# Altium schematic sheet Protection_Circuit.SchDoc
size A2; SheetNumber: 1; SheetTotal: 3
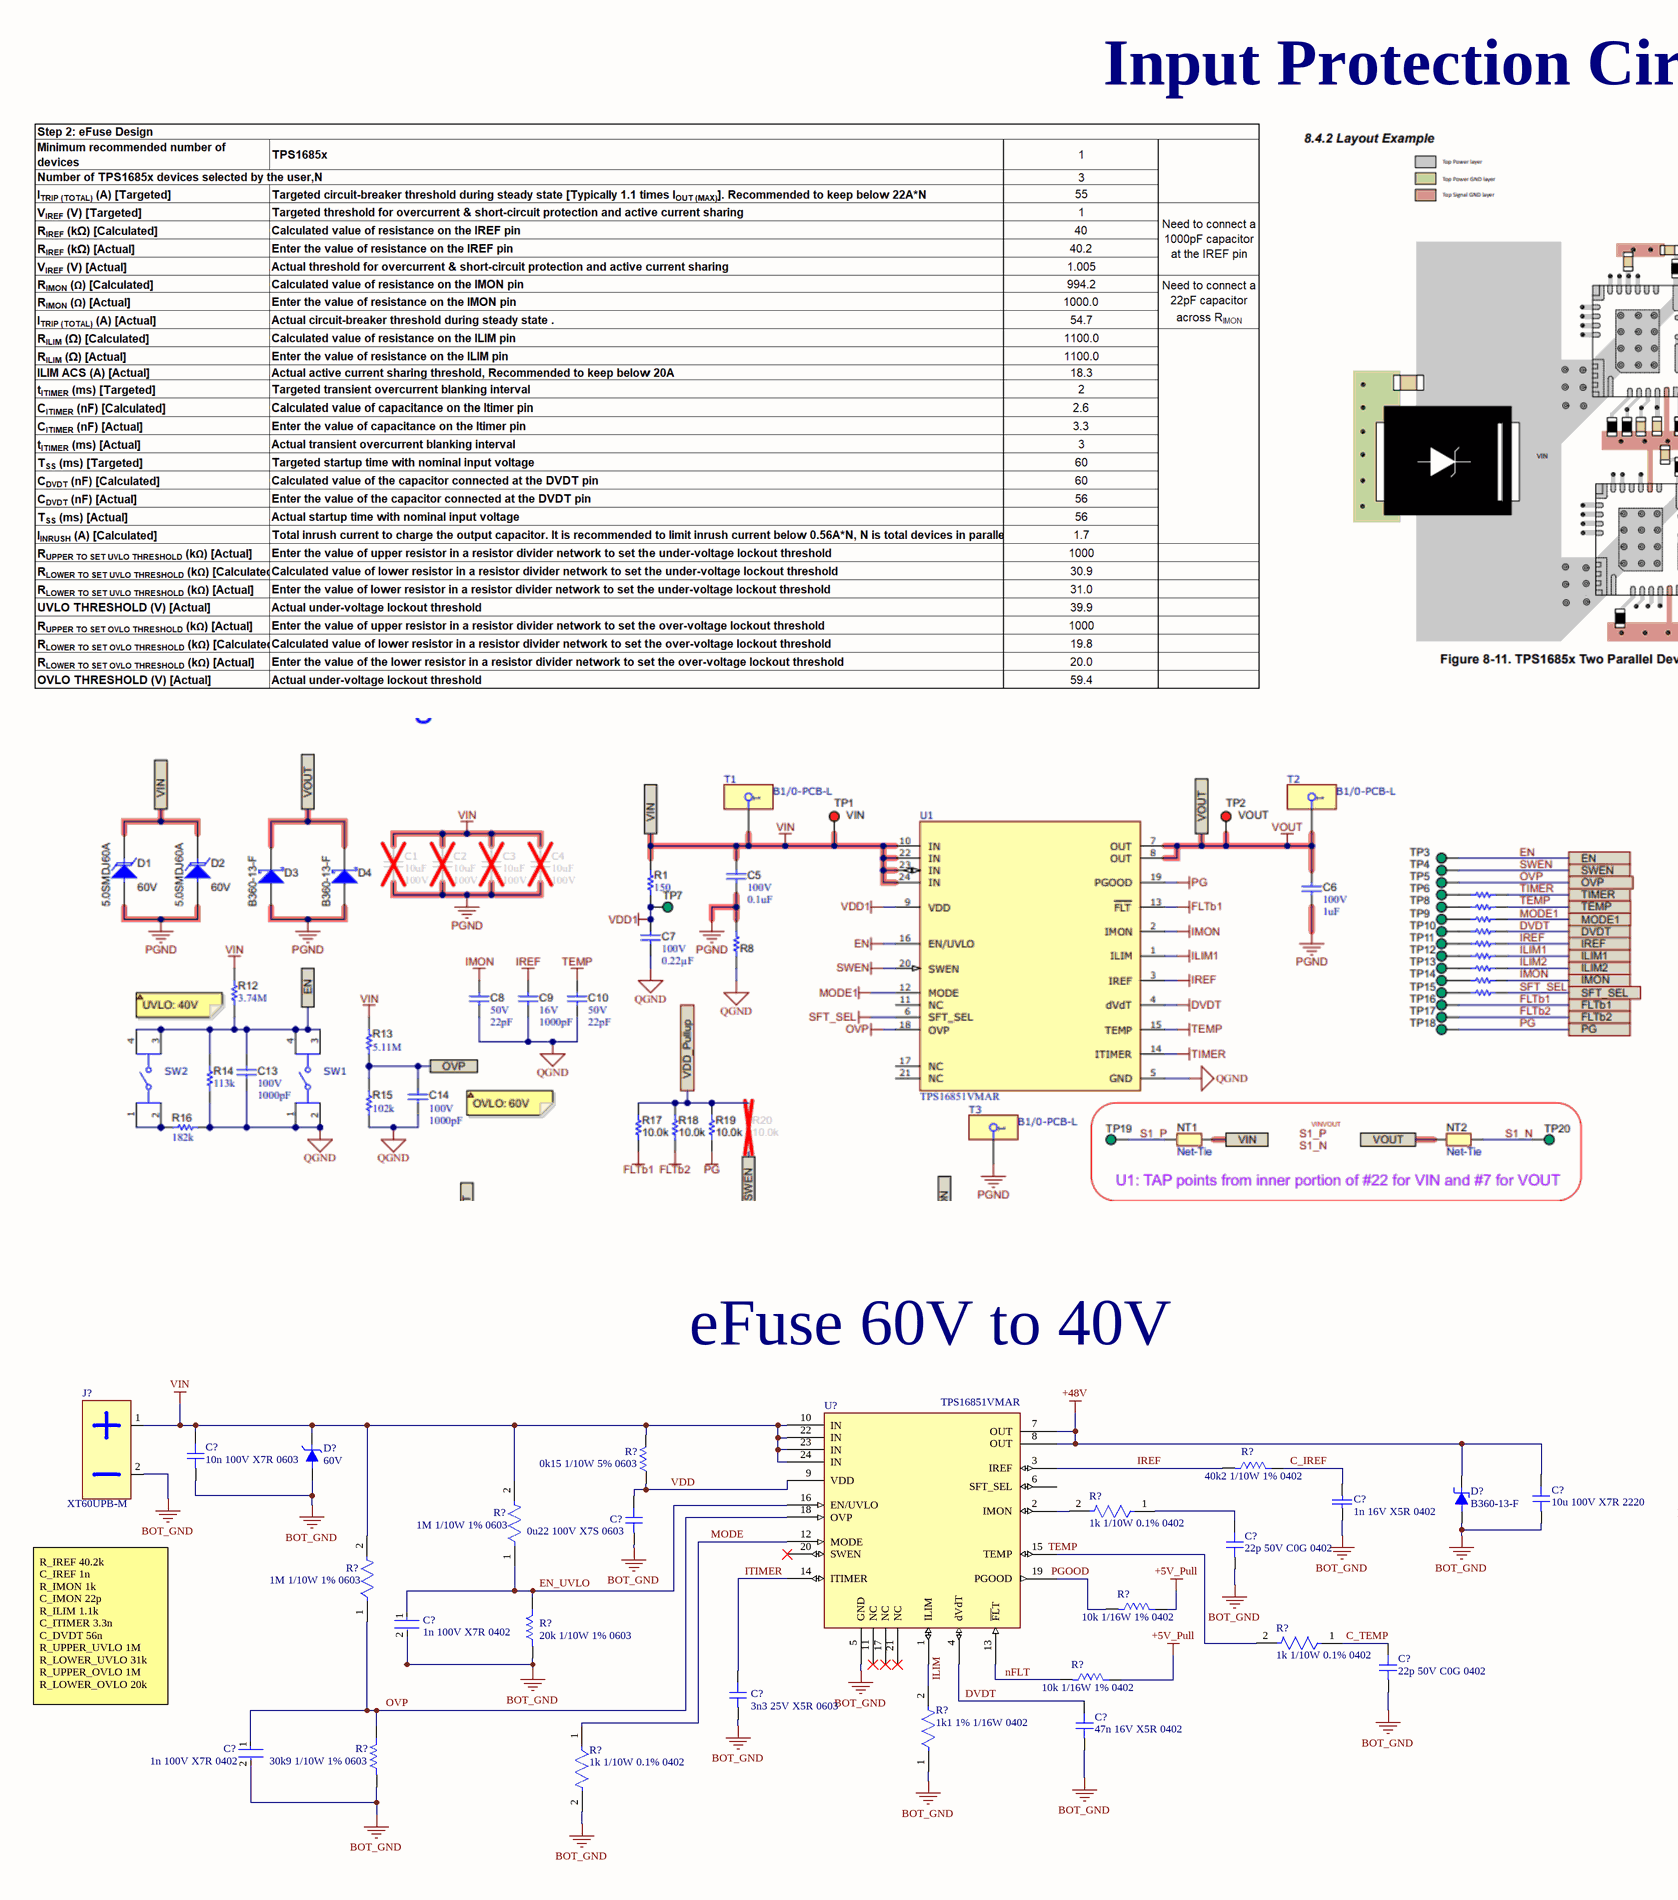
[diagram p0: Protection_Circuit.SchDoc, left]
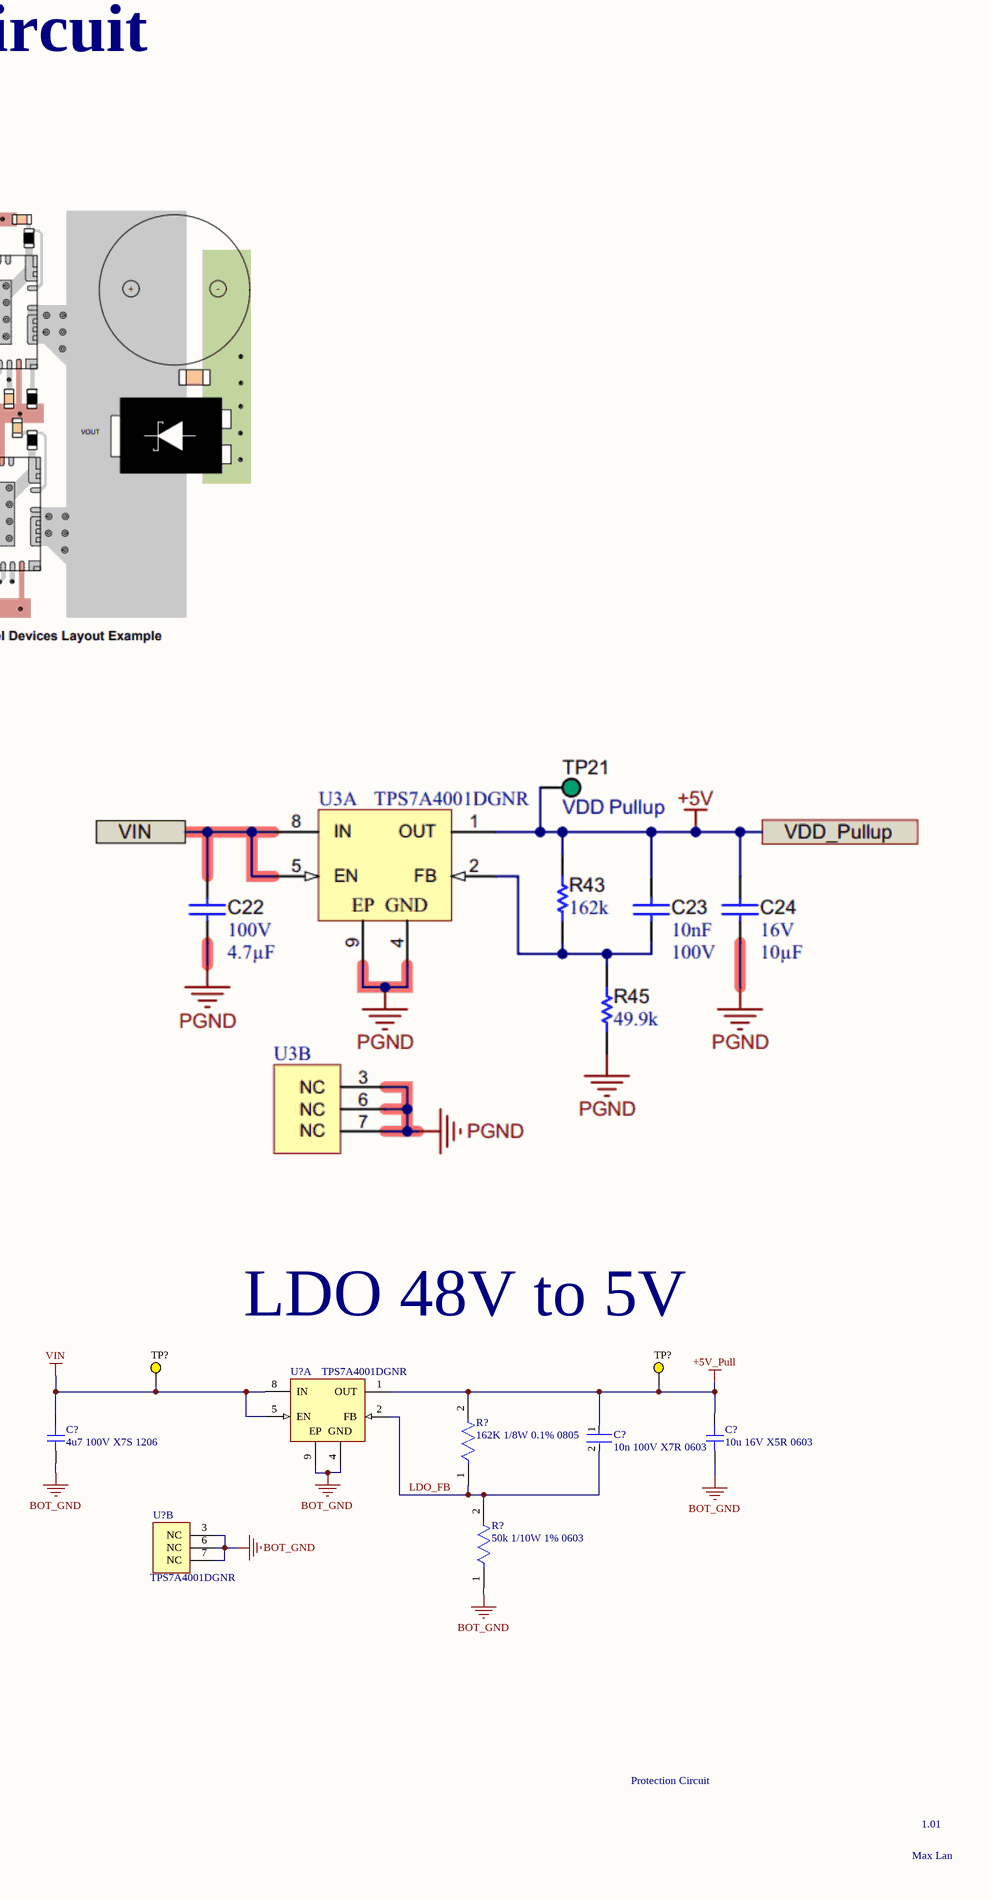
[diagram p1: Protection_Circuit.SchDoc, right]

## Parts
(Parts that share a designator on the sheet are numbered #1, #2 ... from top to bottom, then left to right.)
C?#1  10n 100V X7R 0603  [FP-GRM188-0_1-e0_2_0_5-IPC_A]
C?#2  4u7 100V X7S 1206  [CAP_1206]
C?#3  10u 16V X5R 0603  [CAP_0603]
C?#4  10n 100V X7R 0603  [CAP_0603]
C?#5  10u 100V X7R 2220  [CAP_2220]
C?#6  1n 16V X5R 0402  [CAPC1005X55X25NL05T10]
C?#7  0u22 100V X7S 0603  [CAP_0603]
C?#8  22p 50V C0G 0402  [CAP_0402]
C?#9  1n 100V X7R 0402  [FP-GRM155-0_05-IPC_C]
C?#10  22p 50V C0G 0402  [CAP_0402]
C?#11  3n3 25V X5R 0603  [CAP_0603]
C?#12  47n 16V X5R 0402  [CAP_0402]
C?#13  1n 100V X7R 0402  [FP-GRM155-0_05-IPC_C]
D?#1  60V  [5.0SMDJ60A]
D?#2  B360-13-F  [B360-13-F]
J?  XT60UPB-M  [XT60UPB-M]
R?#1  0k15 1/10W 5% 0603  [RES_0603]
R?#2  40k2 1/10W 1% 0402  [RES_0402]
R?#3  162K 1/8W 0.1% 0805  [FP-RT0805-MFG]
R?#4  1k 1/10W 0.1% 0402  [FP-RP73P-1E-MFG]
R?#5  1M 1/10W 1% 0603  [FP-CRCW0603-e3-MFG]
R?#6  50k 1/10W 1% 0603  [FP-AC0603-IPC_A]
R?#7  10k 1/16W 1% 0402  [RES_0402]
R?#8  1M 1/10W 1% 0603  [FP-CRCW0603-e3-MFG]
R?#9  20k 1/10W 1% 0603  [RES_0603]
R?#10  1k 1/10W 0.1% 0402  [FP-RP73P-1E-MFG]
R?#11  10k 1/16W 1% 0402  [RES_0402]
R?#12  1k 1/10W 0.1% 0402  [FP-RP73P-1E-MFG]
R?#13  30k9 1/10W 1% 0603  [RES_0603]
R?#14  1k1 1% 1/16W 0402  [FP-CRCW0402-e3-MFG]
TP?#1  5014  [KSTN-5014_V]  (value not drawn)
TP?#2  5014  [KSTN-5014_V]  (value not drawn)
U?#1  TPS7A4001DGNR  [DGN0008B_M]  (part A of 2)
U?#2  TPS16851VMAR  [TPS16851VMAR]
U?#3  TPS7A4001DGNR  [DGN0008B_M]  (part B of 2)

## Nets
+5V_Pull: C?#1.1 C?#3.2 R?#3.2 R?#7.2 R?#11.2 TP?#2.1 U?#1.1(OUT)
+48V: C?#5.2 D?#2.K U?#2.7(OUT) U?#2.8(OUT)
BOT_GND: C?#2.1 C?#3.1 C?#4.1 C?#5.1 C?#6.1 C?#7.1 C?#8.1 C?#9.2 C?#10.1 C?#11.1 C?#12.1 C?#13.2 D?#1.A D?#2.A J?.2(V-) R?#6.1 R?#9.1 R?#12.2 R?#13.1 R?#14.1 U?#1.4(GND) U?#1.9(EP) U?#2.5(GND) U?#3.3(NC) U?#3.6(NC) U?#3.7(NC)
VIN: C?#2.2 C?#4.2 D?#1.K J?.1(V+) R?#1.2 R?#5.2 R?#8.2 TP?#1.1 U?#1.5(EN) U?#1.8(IN) U?#2.10(IN) U?#2.22(IN) U?#2.23(IN) U?#2.24(IN)
C_IREF: C?#6.2 R?#2.2
C_TEMP: C?#10.2 R?#10.1
DVDT: C?#12.2 U?#2.4(dVdT)
EN_UVLO: C?#9.1 R?#5.1 R?#9.2 U?#2.16(EN/UVLO)
IREF: R?#2.1 U?#2.3(IREF)
ITIMER: C?#11.2 U?#2.14(ITIMER)
LDO_FB: C?#1.2 R?#3.1 R?#6.2 U?#1.2(FB)
MODE: R?#12.1 U?#2.12(MODE)
nFLT: R?#11.1 U?#2.13(~{FL}T)
OVP: C?#13.1 R?#8.1 R?#13.2 U?#2.18(OVP)
VDD: C?#7.2 R?#1.1 U?#2.9(VDD)
NetC?#8_2: C?#8.2 R?#4.1
NetR?#4_2: R?#4.2 U?#2.2(IMON)
NetR?#7_1: R?#7.1 U?#2.19(PGOOD)
NetR?#10_2: R?#10.2 U?#2.15(TEMP)
NetR?#14_2: R?#14.2 U?#2.1(ILIM)

Not connected (* = marked no-connect by the designer): U?#2 6(SFT_SEL) 11(NC)* 17(NC)* 20(SWEN)* 21(NC)*

## Notes on the sheet
- Input Protection Circuit
- eFuse 60V to 40V
- LDO 48V to 5V
- R_IREF 40.2k
  C_IREF 1n
  R_IMON 1k
  C_IMON 22p
  R_ILIM 1.1k
  C_ITIMER 3.3n
  C_DVDT 56n
  R_UPPER_UVLO 1M
  R_LOWER_UVLO 31k
  R_UPPER_OVLO 1M
  R_LOWER_OVLO 20k
- Protection Circuit
- Max Lan
- 1.01
- Labels drawn without touching a wire or pin: ILIM, PGOOD, TEMP

## Library data of the parts
C?#1 = CMP-2006-02943-2: Chip Multilayer Ceramic Capacitors for General Purpose, 0603, 10000pF, X7R, 15%, 10%, 100V; Capacitance: 10nF; Dielectric: X7R; Material: Ceramic; Package Quantity: 4000; Voltage: 100V; Mount: Surface Mount; Min Operating Temperature: -55°C; Thickness: 0.035inch; Height: 0.8mm; Max Operating Temperature: 125°C; Radiation Hardening: No; Lead Free: Lead Free; Case Code (Metric): 1608; REACH SVHC: No SVHC; Termination: SMD/SMT; Tolerance: 10%; Voltage Rating: 100V; Voltage Rating (DC): 100V; Length: 1.6mm; Depth: 0.8mm; Width: 0.031inch; Case Code (Imperial): 0603; Case/Package: 0603; Packaging: Tape and Reel
C?#2 = KGM31HS72A475MU: 多層陶瓷電容器MLCC - SMD/SMT 100V 4.7uF X7S 1206 20%; Manufacutrer Name: KYOCERA; ComponentLink1Description: Datasheet LInk; ComponentLink1URL: https://ele.kyocera.com/assets/products/capacitor/KGM_Series_e.pdf
C?#3 = GRM188R61C106KAALD: 多層陶瓷電容器MLCC - SMD/SMT 10UF 16V 10% 0603; Manufacturer Name: Murata Electronics; ComponentLink1Description: Datasheet Link; ComponentLink1URL: https://www.mouser.com/catalog/specsheets/murata_03052018_GRM_Series_1.pdf?_gl=1*1uovlwv*_gcl_aw*R0NMLjE3ODQ1OTgwMzkuQ2owS0NRandqdmZTQmhEcEFSSXNBRWlPcFN0OVBSenJuN3UzcXpERGZyOC0yQ0hyNWJjY1BsckdUVXBrWDZGbDZyQ0drclJpS2xFWEltUWFBbGowRUFMd193Y0I.*_gcl_au*MTM0NzYwMzc0Mi4xNzgyNDQ3MDMwLjE2MTAxNDg0NDIuMTc4NDYwODE2My4xNzg0NjExMjA3LjEwOTY4MDgwOTguMTc4NDUzMjk5MC4xNzg0NjExMjA3*_ga*MTg5NTU5OTIyLjE3ODI0NDcwMzM.*_ga_15W4STQT4T*czE3ODQ2MDc5OTEkbzcwJGcxJHQxNzg0NjExMjEzJGo0NyRsMCRoMA..
C?#4 = GRM188R72A103KA01D: 多層陶瓷電容器MLCC - SMD/SMT 0.01 uF 100 VDC 10% 0603 X7R; Manufacturer Name: Murata Electronics; ComponentLink1Description: Datasheet Link; ComponentLink1URL: https://pim.murata.com/asset/pim4/ceramicCapacitorSMD/GRM188R72A103KA01-01A-EN_PDF_CERAMICCAPACITORSMD
C?#5 = 22201C106KAZ2A: 多層陶瓷電容器MLCC - SMD/SMT KGF55CR72A106KV NEW GLOBAL PN 100V 10uF A 581-KGF55CR72A106KV; Manufacturer Name: KYOCERA AVX; ComponentLink1Description: Datasheet Link; ComponentLink1URL: https://datasheets.kyocera-avx.com/KGF.pdf
C?#6 = CMP-2008-03967-1: 多層陶瓷電容器MLCC - SMD/SMT 1000 pF 16 VDC 10% 0402 X5R; Manufacturer: Murata; Part Number: GRM155R61C102KA01D
C?#7 = HMK107C7224KAHTE: 多層陶瓷電容器MLCC - SMD/SMT 963-MCASH168SC7224KT RPLCMT PN 100V 0.22uF X7S 0603 AEC-Q200; Manufacturer Name: Taiyo Yuden; ComponentLink1Description: Datasheet Link; ComponentLink1URL: https://www.mouser.com/catalog/specsheets/taiyo%20yuden_12132018_mlcc11_hq_e.pdf?_gl=1*1pvq3v3*_gcl_aw*R0NMLjE3ODQ1OTgwMzkuQ2owS0NRandqdmZTQmhEcEFSSXNBRWlPcFN0OVBSenJuN3UzcXpERGZyOC0yQ0hyNWJjY1BsckdUVXBrWDZGbDZyQ0drclJpS2xFWEltUWFBbGowRUFMd193Y0I.*_gcl_au*MTM0NzYwMzc0Mi4xNzgyNDQ3MDMwLjE2MTAxNDg0NDIuMTc4NDYwODE2My4xNzg0NjA5OTI4LjEwOTY4MDgwOTguMTc4NDUzMjk5MC4xNzg0NjA5OTI4*_ga*MTg5NTU5OTIyLjE3ODI0NDcwMzM.*_ga_15W4STQT4T*czE3ODQ2MDc5OTEkbzcwJGcxJHQxNzg0NjA5OTQxJGo0NyRsMCRoMA..
C?#8 C?#10 = GRM1555C1H220FA01D: 多層陶瓷電容器MLCC - SMD/SMT 22 pF 50 VDC 1% 0402 C0G (NP0); Manufacturer Name: Murata Electronics; ComponentLink1Description: Datasheet Link; ComponentLink1URL: https://pim.murata.com/asset/pim4/ceramicCapacitorSMD/GRM1555C1H220FA01-01A-EN_PDF_CERAMICCAPACITORSMD
C?#9 C?#13 = CMP-1034-01633-3: Chip Multilayer Ceramic Capacitors for General Purpose, 0402, 1000pF, X7R, 15%, 10%, 100V; Capacitance: 1nF; Width: 0.5mm; Radiation Hardening: No; Min Operating Temperature: -55°C; Lead Free: Lead Free; Voltage Rating: 100V; Max Operating Temperature: 125°C; Case Code (Imperial): 0402; Case/Package: 0402; Depth: 0.5mm; Case Code (Metric): 1005; Height: 0.5mm; Termination: SMD/SMT; Thickness: 0.022inch; Material: Ceramic; Dielectric: X7R; Package Quantity: 10000; Tolerance: 10%; Packaging: Tape and Reel; Length: 1mm; REACH SVHC: No SVHC; Voltage: 100V; Mount: Surface Mount; Voltage Rating (DC): 100V
C?#11 = 02013D332KAT2A: 多層陶瓷電容器MLCC - SMD/SMT KGM03AR51E332KH NEW GLOBAL PN 25V 3300pF A 581-KGM03AR51E332KH; Manufacturer Name: KYOCERA; ComponentLink1Description: Datasheet Link; ComponentLink1URL: https://www.mouser.tw/datasheet/3/5926/1/cx5r_KGM.pdf
C?#12 = GRM155R61C473KA01D: 多層陶瓷電容器MLCC - SMD/SMT 47nF 16 VDC 10% 0402 X5R; Manufacturer Name: Murata Electronics; ComponentLink1Description: Datasheet Link; ComponentLink1URL: https://www.mouser.tw/datasheet/3/76/2/GRM155R61C473KA01_01A.pdf
D?#1 = 5.0SMDJ60A: ESD 保護二極體 / TVS 二極體 60V 5KW 5% UNI DO-214AB (SMC); Manufacturer Name: Bourns; ComponentLink1Description: Datasheet Link; ComponentLink1URL: https://www.mouser.tw/datasheet/3/40/1/5_0smdj.pdf
D?#2 = B360-13-F: 肖特基二極體及整流器 60V 3A
J? = XT60UPB-M: XT60 vertical male 2-pin AMASS; Manufacturer: AMASS; Manufacturer Part Number: XT60UPB-M
R?#1 = CRCW0603150RJNEAC: 厚膜電阻器 - SMD 1/10Watt 150ohms 5% Commercial Use; Manufacturer Name: Vishay; ComponentLink1Description: Datasheet Link; ComponentLink1URL: https://www.vishay.com/docs/20035/dcrcwe3.pdf
R?#2 = ERJ-2RKF4022X: 厚膜電阻器 - SMD 0402 40.2Kohms 1% AEC-Q200; Manufacturer Name: Panasonic; ComponentLink1Description: Datasheet Link; ComponentLink1URL: https://industrial.panasonic.com/cdbs/www-data/pdf/RDA0000/AOA0000C304.pdf
R?#3 = CMP-03412-025870-1: RES SMD 162K OHM 0.1% 1/8W 0805; Manufacturer: Yageo; Manufacturer Part Number: RT0805BRD07162KL; Voltage Rating: 150V; Power Rating: 0.125W; Tolerance: 0.0025; Resistance: 162KΩ; Temperature Coefficient: 25 ppm/°C; Value: 162KΩ; Temperature Range High: +155°C; RoHS: TRUE; Digikey Description: RES SMD 162K OHM 0.1% 1/8W 0805; Lead Free: Yes; Package: RT0805; Automotive: No; Ipc Land Pattern Name: RESC200125X50; Mouser Description: Thin Film Resistors - SMD 1/8W 162K ohm .1% 25ppm; Footprint Url: http://www.yageo.com/exep/pages/download/literatures/PYu-R_Mount_10.pdf; Device Class L1: Passive Components; Composition: Thin Film; ComponentLink2URL: http://www.yageo.com/documents/recent/PYu-RT_1-to-0.01_RoHS_L_9.pdf; Temperature: -55°C to +155°C; Device Class L3: Chip SMD Resistors; ComponentLink2Description: Datasheet; Series: RT; Temperature Range Low: -55°C; Height: 0.6mm; Category: Res; Octopart: https://octopart.com/rt0805brd07162kl-yageo-1203988; Device Class L2: Resistors
R?#4 R?#10 R?#12 = CMP-03211-007481-1: RP73P 0402 1KΩ 0.1W 25ppm/°C 0.10% 50V; Manufacturer Part Number: RP73PF1E1K0BTD; Manufacturer: TE Connectivity; Device Class L1: Passive Components; Height: 0.35mm; Composition: Thin Film; Package: RP73P-1E; ComponentLink2Description: Datasheet; Category: Res; Value: 1KΩ; Lead Free: Yes; Device Class L3: Chip SMD Resistors; Temperature Coefficient: 25ppm/°C; Temperature: -55°C to +155°C; Series: RP73P; Device Class L2: Resistors; Power Rating: 0.1W; Voltage Rating: 50V; Octopart: https://octopart.com/rp73pf1e1k0btd-te+connectivity-89230009; Automotive: No; Tolerance: 0.10%; Temperature Range High: +155°C; RoHS: TRUE; ComponentLink2URL: https://www.te.com/commerce/DocumentDelivery/DDEController?Action=srchrtrv&DocNm=1773272&DocType=DS&DocLang=English; Temperature Range Low: -55°C; Resistance: 1KΩ; Ipc Land Pattern Name: RESC10050X30
R?#5 R?#8 = CMP-2000-03013-2: RES Thick Film, 1MΩ, 1%, 0.1W, 100ppm/°C, 0603; Max Power Dissipation: 100mW; Resistance: 1MR; Voltage Rating (DC): 75V; Depth: 0.85mm; Max Operating Temperature: 155°C; Length: 1.55mm; Power Rating: 100mW; Military Standard: Not; Features: Automotive AEC-Q200; Min Operating Temperature: -55°C; Number of Pins: 2; Mount: Surface Mount; Package Quantity: 10; Packaging: Tape and Reel; Height: 0.45mm; Radiation Hardening: No; Case Code (Metric): 1608; Temperature Coefficient: 100ppm/°C; Width: 0.85mm; Composition: Thick Film; Termination: SMD/SMT; Tolerance: 1%; Number of Terminations: 2; Lead Free: Lead Free; Contact Plating: Tin; Case/Package: 0603; Weight: 7.1E-05oz; Voltage Rating: 75V; Case Code (Imperial): 0603
R?#6 = CMP-2000-04846-3: RES 49.9KΩ 1.00% 0.1W 0603; Max Power Dissipation: 100mW; Resistance: 49.9kR; Voltage Rating: 50V; Temperature Coefficient: 100ppm/°C; Max Operating Temperature: 155°C; Construction: Rectangular; Lead Free: Lead Free; Number of Terminations: 2; RoHS Compliant: Yes; Case/Package: 0603; Packaging: Tape and Reel; Tolerance: 1%; Military Standard: Not; Termination: SMD/SMT; Ratings: AEC-Q200; Length: 0.063inch; Case Code (Imperial): 0603; Depth: 0.8mm; Min Operating Temperature: -55°C; Series: AC; Case Code (Metric): 1608; Height: 0.022inch; Package Quantity: 5000; Features: Moisture Resistant; Width: 0.031inch; Resistor Type: Thick Film; Power Rating: 100mW
R?#7 R?#11 = RC0402FR-0710KL: 厚膜電阻器 - SMD General Purpose Chip Resistor 0402, 10kOhms, 1%, 1/16W; Manufacturer Name: Yageo; ComponentLink1Description: Datasheet Link; ComponentLink1URL: https://www.mouser.com/catalog/specsheets/YAGEO_PYu_RC_Group_51_RoHS_L_12.pdf?_gl=1*6co0c6*_gcl_aw*R0NMLjE3ODQ1OTgwMzkuQ2owS0NRandqdmZTQmhEcEFSSXNBRWlPcFN0OVBSenJuN3UzcXpERGZyOC0yQ0hyNWJjY1BsckdUVXBrWDZGbDZyQ0drclJpS2xFWEltUWFBbGowRUFMd193Y0I.*_gcl_au*MTM0NzYwMzc0Mi4xNzgyNDQ3MDMwLjE2MTAxNDg0NDIuMTc4NDYwODE2My4xNzg0NjExMzM4LjEwOTY4MDgwOTguMTc4NDUzMjk5MC4xNzg0NjExMzM4*_ga*MTg5NTU5OTIyLjE3ODI0NDcwMzM.*_ga_15W4STQT4T*czE3ODQ2MDc5OTEkbzcwJGcxJHQxNzg0NjExOTEyJGozNSRsMCRoMA..
R?#9 = RC0603FR-1320KL: 厚膜電阻器 - SMD General Purpose Chip Resistor 0603, 20kOhms, 1%, 1/10W; Manufacturer Name: YAGEO; ComponentLink1Description: Datasheet Link; ComponentLink1URL: https://www.mouser.com/catalog/specsheets/YAGEO_PYu_RC_Group_51_RoHS_L_12.pdf?_gl=1*1h9bpwz*_gcl_aw*R0NMLjE3ODQ2MTY4NTMuQ2owS0NRandqdmZTQmhEcEFSSXNBRWlPcFN1NHcySlJHOUhIbER5ZEphZFl4S3phN29Sa0V3N3FSbWZKbGNaV1FTamoxUzNmdzU0bGpTb2FBaXZuRUFMd193Y0I.*_gcl_au*MTM0NzYwMzc0Mi4xNzgyNDQ3MDMwLjI2NDM1NTk0NS4xNzg0NjE1MjUxLjE3ODQ2MTczNjMuMTA5NjgwODA5OC4xNzg0NTMyOTkwLjE3ODQ2MTczNjM.*_ga*MTg5NTU5OTIyLjE3ODI0NDcwMzM.*_ga_15W4STQT4T*czE3ODQ2MTUyNDkkbzcxJGcxJHQxNzg0NjE3MzY2JGo0NiRsMCRoMA..
R?#13 = AC0603FR-0730K9L: 厚膜電阻器 - SMD 30.9 kOhms 1/10 W 75 V 1% 0603 100 PPM / C - 55 C / + 155 C AEC-Q200; Manufacturer Name: YAGEO; ComponentLink1Description: Datasheet Link; ComponentLink1URL: https://www.mouser.tw/datasheet/3/508/1/PYu-AC_51_RoHS_L_11.pdf
R?#14 = CMP-2002-08280-2: RES Thick Film, 1.1kΩ, 1%, 0.063W, 100ppm/°C, 0402; Voltage Rating: 50V; Max Power Dissipation: 63mW; Resistance: 1.1kR; Lead Free: Lead Free; Min Operating Temperature: -55°C; Case Code (Metric): 1005; Case/Package: 0402; Mount: Surface Mount; Contact Plating: Tin; Military Standard: Not; Height: 0.35mm; Termination: SMD/SMT; Features: Automotive AEC-Q200; Case Code (Imperial): 0402; Working Voltage: 50V; Max Operating Temperature: 155°C; Number of Pins: 2; Composition: Thick Film; Package Quantity: 10; Packaging: Tape and Reel; Number of Terminations: 2; Radiation Hardening: No; Temperature Coefficient: 100ppm/°C; Length: 1mm; Weight: 2.3E-05oz; Tolerance: 1%; Depth: 0.5mm; Voltage Rating (DC): 50V; Power Rating: 63mW; Width: 0.5mm
TP?#1 TP?#2 = CMP-1672-00006-4: Test Point, Yellow, Through Hole, RoHS, Bulk; Manufacturer: Keystone; PackageDescription: 1-Pin Through Hole Device, Dia 3.17 mm; REACH SVHC: No SVHC; ComponentLink2Description: Datasheet; ComponentLink2URL: http://www.keyelco.com/product-pdf.cfm?p=1323; Package Quantity: 100; Colour: Yellow; Height: 8.12 mm; RoHSCompliant: true; Contact Material: Bronze; Mount: Through Hole; Contact Plating: Silver; ComponentLink1URL: http://www.keyelco.com/; Packaging: Bulk; Mounting Technology: Through Hole; PackageReference: 5014; ComponentLink1Description: Manufacturer URL; DatasheetVersion: Rev. F, 12/2013
U?#1 U?#3 = CMP-0394-01258-2: Single Output LDO, 50 mA, Adjustable 1.175 to 90 V Output, 7 to 100 V Input, 8-pin MSOP (DGN), -40 to 125 degC, Green (RoHS & no Sb/Br); Manufacturer: Texas Instruments; Iout(Max)(A): 0.05; Vin(Max)(V): 100; Vout Adj(Min)(V): 1.2; Accuracy(%): 2.5; SubFamily: Single Channel LDO; Vin(Min)(V): 7; Iq(Typ)(mA): 0.02; Vdo(Typ)(mV): 290; Vout Adj(Max)(V): 90; ComponentLink1URL: http://www.ti.com/; PackageDescription: 8-Pin Plastic Small Outline, Body 3 x 3 mm, Pitch 0.65 mm; PartNumber: TPS7A4001DGNR; Mounting Technology: Surface Mount; PackageReference: DGN0008B; ComponentLink1Description: Manufacturer URL; Code_JEDEC: MO-187; DatasheetVersion: SBVS162A; ComponentLink2URL: http://www.ti.com/general/docs/lit/getliterature.tsp?genericPartNumber=TPS7A4001&fileType=pdf; ComponentLink2Description: Datasheet; Eco-Plan: Green (RoHS & no Sb/Br); PackageVersion: 4073271/F; ComponentLink3URL: http://www.ti.com/litv/pdf/mpds046e; ComponentLink3Description: Package Specification
U?#2 = TPS16851VMAR: TPS1685x 9V to 80V, 3.5mΩ, 20A Stackable Integrated Hotswap (eFuse) With Accurate / and Fast Current Monitor; Manufacturer Name: Texas Instruments; Distributor Name: Mouser; ComponentLink1Description: Distributor Link; ComponentLink1URL: https://www.mouser.tw/zh/ProductDetail/Texas-Instruments/TPS16851VMAR?qs=3GbUB62Nf7eQ%252B8Ekf4UeLw%3D%3D; ComponentLink2Description: Datasheet Link; ComponentLink2URL: https://www.ti.com/lit/ds/symlink/tps1685.pdf